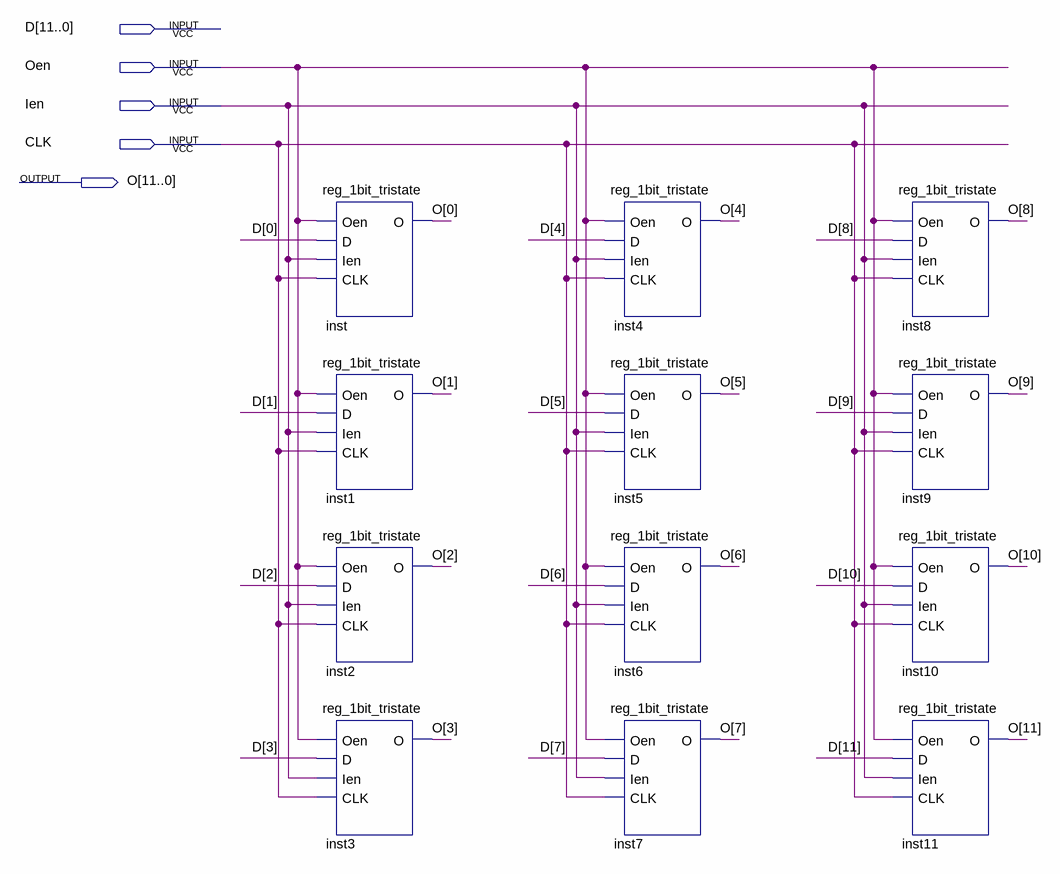
[diagram p0: schematic sheet]
// Quartus schematic reg_12bits_tristate.bdf as structural Verilog: 12 symbols, 5 pins
module reg_12bits_tristate (
  input  [11:0] D,
  input  Oen,
  input  Ien,
  input  CLK,
  output [11:0] O
);

  reg_1bit_tristate inst (.Oen(Oen), .D(D[0]), .Ien(Ien), .CLK(CLK), .O(O[0]));
  reg_1bit_tristate inst1 (.Oen(Oen), .D(D[1]), .Ien(Ien), .CLK(CLK), .O(O[1]));
  reg_1bit_tristate inst2 (.Oen(Oen), .D(D[2]), .Ien(Ien), .CLK(CLK), .O(O[2]));
  reg_1bit_tristate inst3 (.Oen(Oen), .D(D[3]), .Ien(Ien), .CLK(CLK), .O(O[3]));
  reg_1bit_tristate inst4 (.Oen(Oen), .D(D[4]), .Ien(Ien), .CLK(CLK), .O(O[4]));
  reg_1bit_tristate inst5 (.Oen(Oen), .D(D[5]), .Ien(Ien), .CLK(CLK), .O(O[5]));
  reg_1bit_tristate inst6 (.Oen(Oen), .D(D[6]), .Ien(Ien), .CLK(CLK), .O(O[6]));
  reg_1bit_tristate inst7 (.Oen(Oen), .D(D[7]), .Ien(Ien), .CLK(CLK), .O(O[7]));
  reg_1bit_tristate inst8 (.Oen(Oen), .D(D[8]), .Ien(Ien), .CLK(CLK), .O(O[8]));
  reg_1bit_tristate inst9 (.Oen(Oen), .D(D[9]), .Ien(Ien), .CLK(CLK), .O(O[9]));
  reg_1bit_tristate inst10 (.Oen(Oen), .D(D[10]), .Ien(Ien), .CLK(CLK), .O(O[10]));
  reg_1bit_tristate inst11 (.Oen(Oen), .D(D[11]), .Ien(Ien), .CLK(CLK), .O(O[11]));
endmodule
